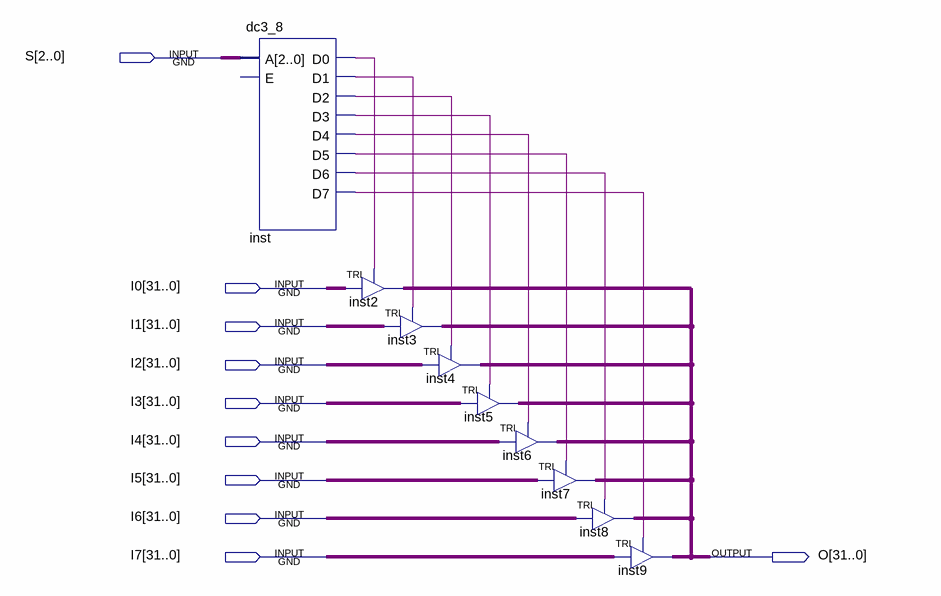
[diagram p0: schematic sheet]
// Quartus schematic mx8_32b.bdf as structural Verilog: 9 symbols, 10 pins
module mx8_32b (
  input  [2:0] S,
  input  [31:0] I0,
  input  [31:0] I1,
  input  [31:0] I2,
  input  [31:0] I3,
  input  [31:0] I4,
  input  [31:0] I5,
  input  [31:0] I6,
  input  [31:0] I7,
  output [31:0] O
);

  wire inst_d0, inst_d1, inst_d2, inst_d3, inst_d4, inst_d5, inst_d6, inst_d7;

  dc3_8 inst (
    .A(S), .D0(inst_d0), .D1(inst_d1), .D2(inst_d2), .D3(inst_d3), .D4(inst_d4), .D5(inst_d5), .D6(inst_d6),
    .D7(inst_d7));  // open: E
  TRI inst2[31:0] (.IN(I0), .OE(inst_d0), .OUT(O));
  TRI inst3[31:0] (.IN(I1), .OE(inst_d1), .OUT(O));
  TRI inst4[31:0] (.IN(I2), .OE(inst_d2), .OUT(O));
  TRI inst5[31:0] (.IN(I3), .OE(inst_d3), .OUT(O));
  TRI inst6[31:0] (.IN(I4), .OE(inst_d4), .OUT(O));
  TRI inst7[31:0] (.IN(I5), .OE(inst_d5), .OUT(O));
  TRI inst8[31:0] (.IN(I6), .OE(inst_d6), .OUT(O));
  TRI inst9[31:0] (.IN(I7), .OE(inst_d7), .OUT(O));
endmodule
